# Altium schematic sheet esp-wroom-32.SchDoc
size A1
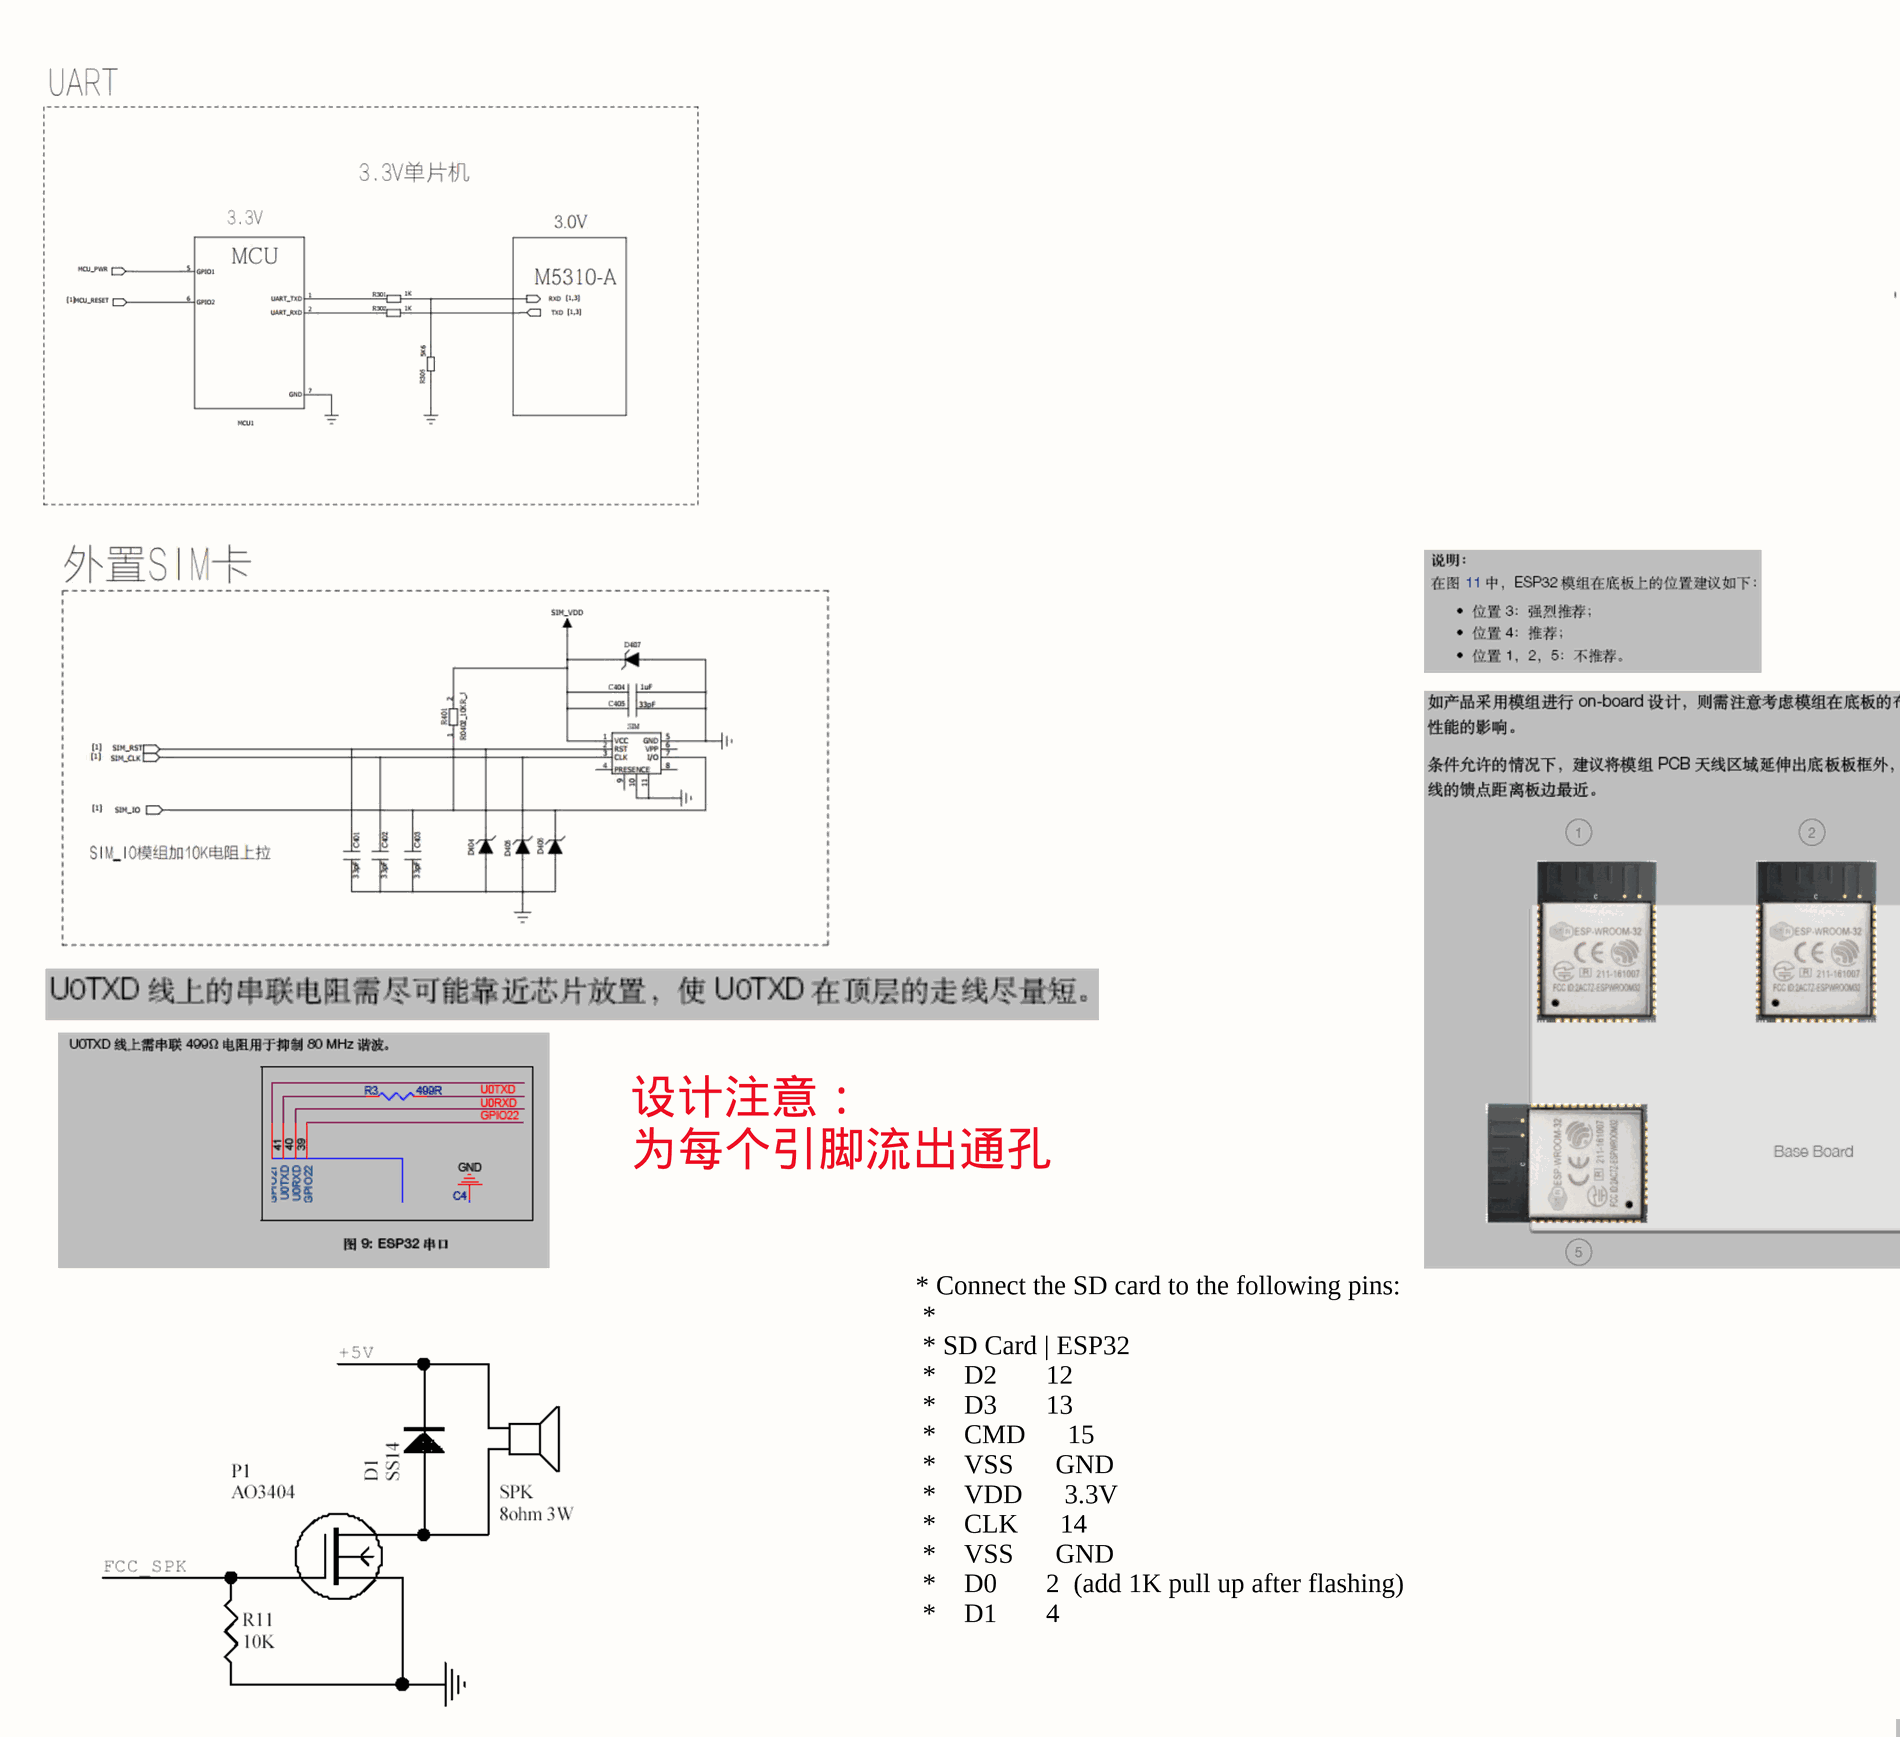
[diagram p0: esp-wroom-32.SchDoc, top left]
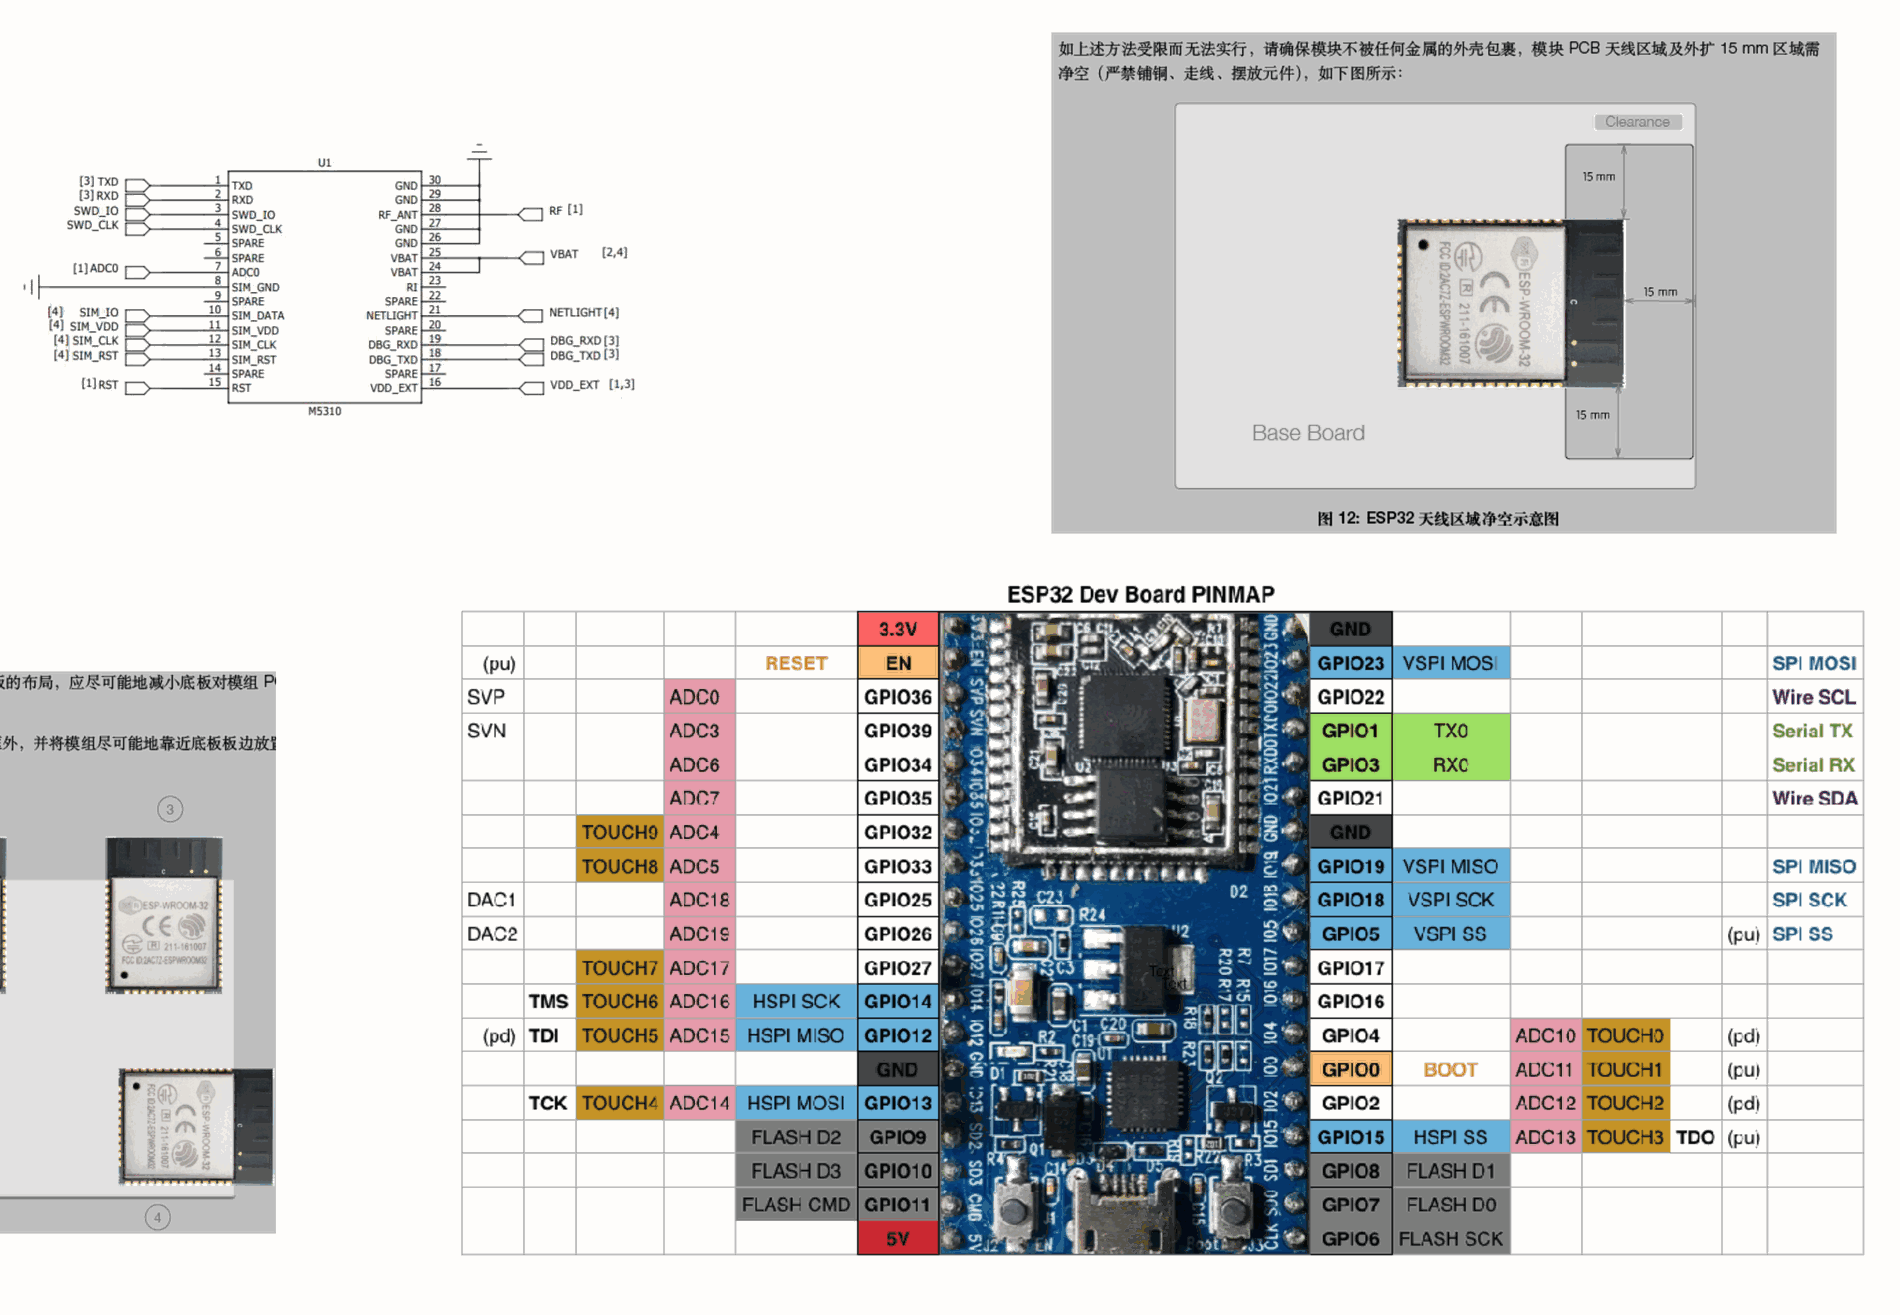
[diagram p1: esp-wroom-32.SchDoc, top right]
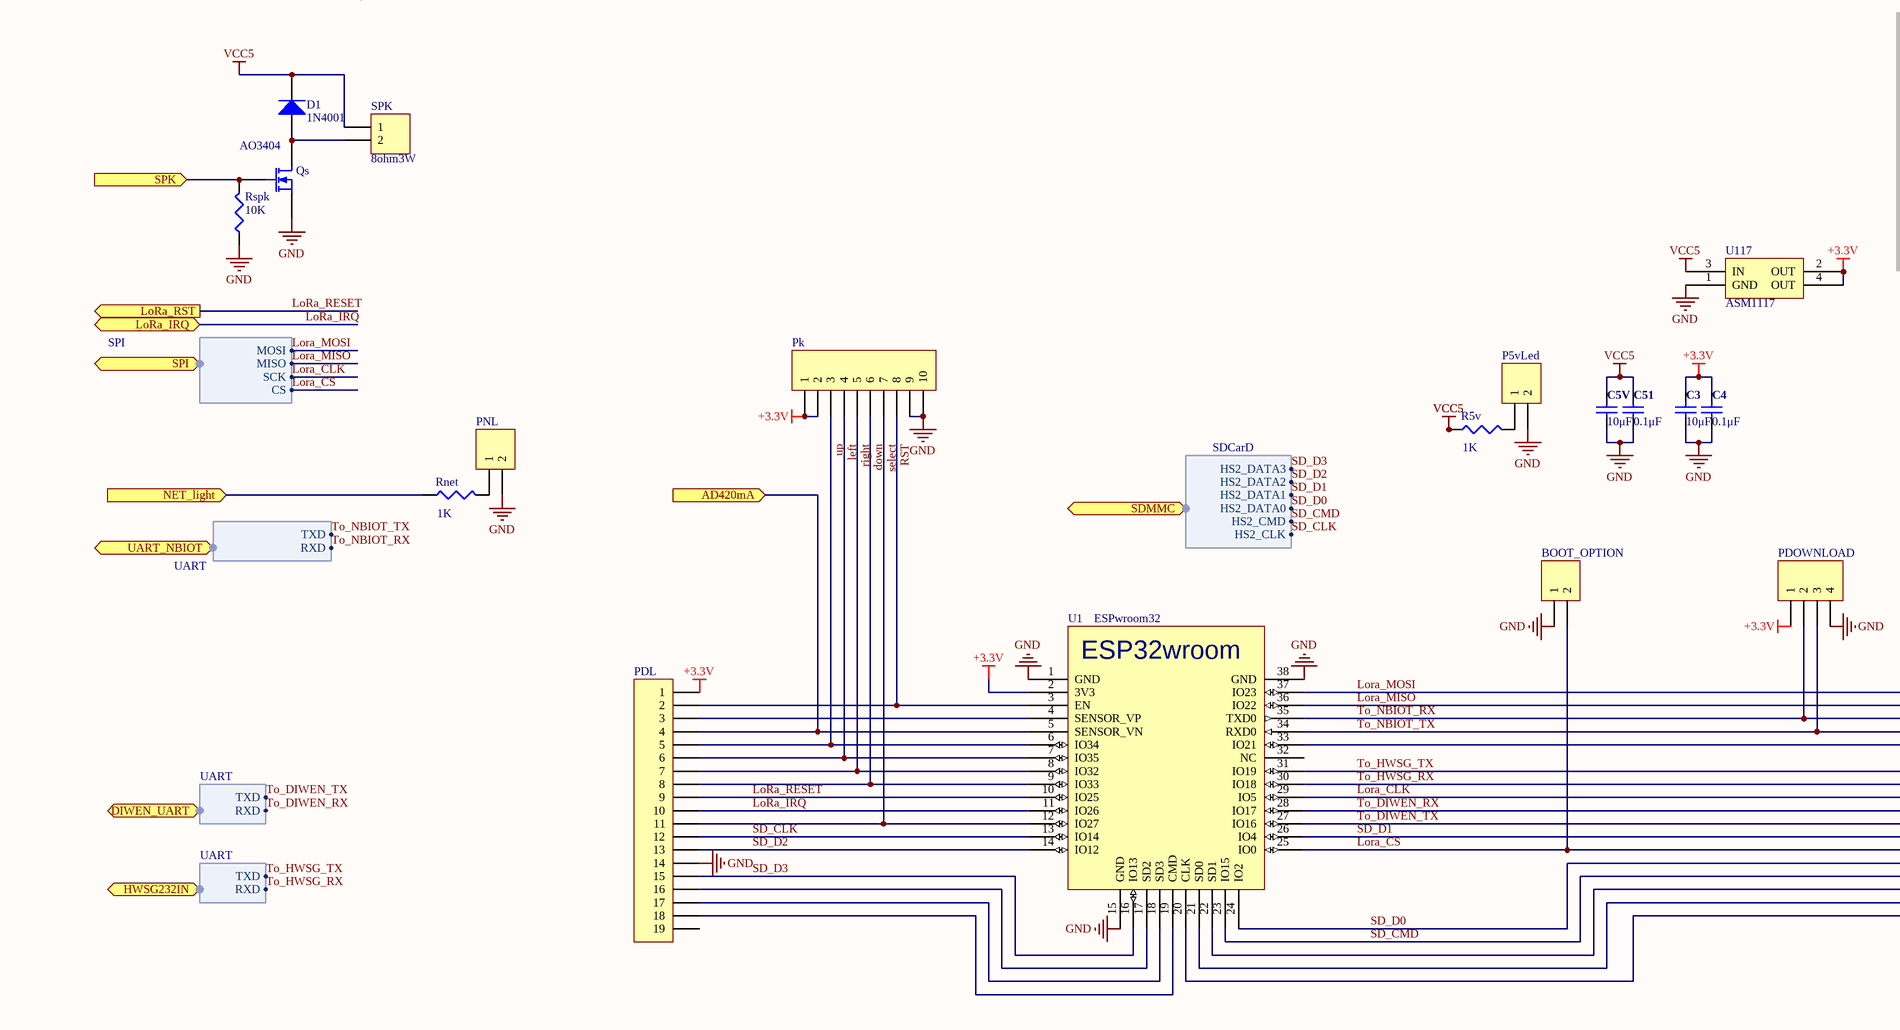
[diagram p2: esp-wroom-32.SchDoc, bottom left]
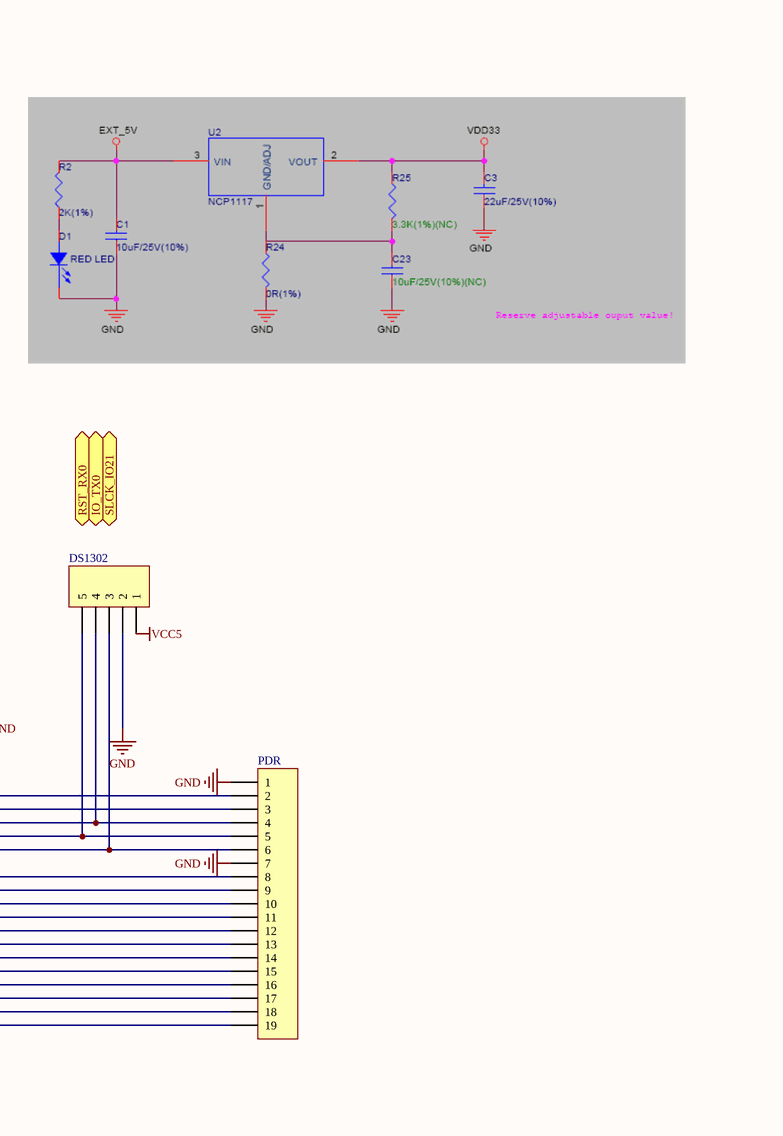
[diagram p3: esp-wroom-32.SchDoc, bottom right]

## Parts
BOOT_OPTION  Header 2  [HDR1X2]  (value not drawn)
C3  10μF  [CAP-7343]
C4  0.1μF  [0805-1]
C5V  10μF  [CAP-7343]
C51  0.1μF  [0805-1]
D1  Type: 1N4001  [DIODE-1206]  (hidden comment: SS14)
DS1302  Header 5  [HDR1X5]  (value not drawn)
P5vLed  Header 2  [HDR1X2]  (value not drawn)
PDL  Header 19  [HDR1X19]  (value not drawn)
PDOWNLOAD  Header 4  [HDR1X4]  (value not drawn)
PDR  Header 19  [HDR1X19]  (value not drawn)
Pk  Header 10  [HDR1X10]  (value not drawn)
PNL  Header 2  [HDR1X2]  (value not drawn)
Qs  AO3404  [E3]
R5v  value 1K  [0805]  (hidden comment: Res3)
Rnet  value 1K  [0805]  (hidden comment: Res3)
Rspk  value 10K  [0805]  (hidden comment: Res3)
SPK  8ohm3W  [HDR1X2]
U1  ESPwroom32  [PCBComponent_1 - duplicate]
U117  ASM1117  [SOT-223]

## Ports
AD420mA (in), DIWEN_UART (harness UART), HWSG232IN (harness UART), IO_TX0 (bidir), LoRa_IRQ (bidir), LoRa_RST (out), NET_light (in), RST_RX0 (in), SDMMC (harness SDCarD), SLCK_IO21 (in), SPI (harness SPI), SPK (in), UART_NBIOT (harness UART)

## Harnesses
SPI: MOSI, MISO, SCK, CS
UART: TXD, RXD
SDCarD: HS2_DATA3, HS2_DATA2, HS2_DATA1, HS2_DATA0, HS2_CMD, HS2_CLK

## Nets
+3.3V: C3.2 C4.2 PDL.1 PDOWNLOAD.1 Pk.1 Pk.2 U1.2(3V3) U117.2(OUT) U117.4(OUT)
GND: BOOT_OPTION.1 C3.1 C4.1 C5V.1 C51.1 DS1302.2 P5vLed.2 PDL.14 PDOWNLOAD.4 PDR.1 PDR.7 Pk.9 Pk.10 PNL.2 Qs.3(S) Rspk.1 U1.1(GND) U1.15(GND) U1.38(GND) U117.1(GND)
VCC5: C5V.2 C51.2 D1.2(K) DS1302.1 R5v.1 SPK.1 U117.3(IN)
AD420mA: PDL.4 U1.5(SENSOR_VN) ; port AD420mA
down: PDL.8 Pk.6 U1.9(IO33)
left: PDL.6 Pk.4 U1.7(IO35)
Lora_CLK: PDR.10 U1.29(IO5) ; port SPI.SCK
Lora_CS: BOOT_OPTION.2 PDR.14 U1.25(IO0) ; port SPI.CS
LoRa_IRQ: PDL.10 U1.11(IO26) ; port LoRa_IRQ
Lora_MISO: PDR.3 U1.36(IO22) ; port SPI.MISO
Lora_MOSI: PDR.2 U1.37(IO23) ; port SPI.MOSI
LoRa_RESET: PDL.9 U1.10(IO25) ; port LoRa_RST
NET_light: Rnet.1 ; port NET_light
right: PDL.7 Pk.5 U1.8(IO32)
RST: PDL.2 Pk.8 U1.3(EN)
SD_CLK: PDL.12 U1.13(IO14) ; port SDMMC.HS2_CLK
SD_CMD: PDR.16 U1.23(IO15) ; port SDMMC.HS2_CMD
SD_D0: PDR.15 U1.24(IO2) ; port SDMMC.HS2_DATA0
SD_D1: PDR.13 U1.26(IO4) ; port SDMMC.HS2_DATA1
SD_D2: PDL.13 U1.14(IO12) ; port SDMMC.HS2_DATA2
SD_D3: PDL.15 U1.16(IO13) ; port SDMMC.HS2_DATA3
select: PDL.11 Pk.7 U1.12(IO27)
SPK: Qs.2(G) Rspk.2 ; port SPK
To_DIWEN_RX: PDR.11 U1.28(IO17) ; port DIWEN_UART.RXD
To_DIWEN_TX: PDR.12 U1.27(IO16) ; port DIWEN_UART.TXD
To_HWSG_RX: PDR.9 U1.30(IO18) ; port HWSG232IN.RXD
To_HWSG_TX: PDR.8 U1.31(IO19) ; port HWSG232IN.TXD
To_NBIOT_RX: DS1302.4 PDOWNLOAD.2 PDR.4 U1.35(TXD0) ; port UART_NBIOT.RXD
To_NBIOT_TX: DS1302.5 PDOWNLOAD.3 PDR.5 U1.34(RXD0) ; port UART_NBIOT.TXD
up: PDL.5 Pk.3 U1.6(IO34)
NetD1_1: D1.1(A) Qs.1(D) SPK.2
NetDS1302_3: DS1302.3 PDR.6 U1.33(IO21)
NetP5vLed_1: P5vLed.1 R5v.2
NetPDL_3: PDL.3 U1.4(SENSOR_VP)
NetPDL_16: PDL.16 U1.17(SD2)
NetPDL_17: PDL.17 U1.18(SD3)
NetPDL_18: PDL.18 U1.19(CMD)
NetPDR_17: PDR.17 U1.22(SD1)
NetPDR_18: PDR.18 U1.21(SD0)
NetPDR_19: PDR.19 U1.20(CLK)
NetPNL_1: PNL.1 Rnet.2

Not connected (* = marked no-connect by the designer): PDL 19; U1 32(NC)

## Notes on the sheet
- 设计注意：
  为每个引脚流出通孔
- * Connect the SD card to the following pins:
  *
  * SD Card | ESP32
  *    D2       12
  *    D3       13
  *    CMD      15
  *    VSS      GND
  *    VDD      3.3V
  *    CLK      14
  *    VSS      GND
  *    D0       2  (add 1K pull up after flashing)
  *    D1       4
  */
- (in symbol ESPwroom32) ESP32wroom

## Library data of the parts
BOOT_OPTION P5vLed PNL SPK = Header 2: Header, 2-Pin; LatestRevisionDate: 17-Jul-2002; LatestRevisionNote: Re-released for DXP Platform.; Publisher: Altium Limited
C3 C4 C51 = Cap: 贴片电容; 名称: 电容; 封装: 0805; 型号: 1μF
C5V = Cap: 贴片电容; 名称: 电容; 封装: 0805; 型号: 10μF
D1 = Diode: 二极管; Published: 8-Jun-2000; LatestRevisionDate: 17-Jul-2002; LatestRevisionNote: Re-released for DXP Platform.; PackageDocument: Sep-1996; PackageReference: SMC; Publisher: Altium Limited; Code_JEDEC: DO-214-AB
DS1302 = Header 5: Header, 5-Pin; LatestRevisionDate: 17-Jul-2002; LatestRevisionNote: Re-released for DXP Platform.; Publisher: Altium Limited
PDL PDR = Header 19: Header, 19-Pin; LatestRevisionDate: 17-Jul-2002; LatestRevisionNote: Re-released for DXP Platform.; Publisher: Altium Limited
PDOWNLOAD = Header 4: Header, 4-Pin; LatestRevisionDate: 17-Jul-2002; LatestRevisionNote: Re-released for DXP Platform.; Publisher: Altium Limited
Pk = Header 10: Header, 10-Pin; LatestRevisionDate: 17-Jul-2002; LatestRevisionNote: Re-released for DXP Platform.; Publisher: Altium Limited
Qs = MOSFET-N: N-Channel MOSFET; Published: 8-Jun-2000; LatestRevisionDate: 17-Jul-2002; LatestRevisionNote: Re-released for DXP Platform.; PackageVersion: 1995/1996; PackageReference: E3; Publisher: Altium Limited; PackageDescription: TO, Flat Index; 3 In-Line, Axial Leads; Body Dia. 4.6mm; Lead Dia. 0.5 mm (max)
R5v Rnet Rspk = Res3: Resistor; Published: 8-Jun-2000; LatestRevisionDate: 29-May-2009; LatestRevisionNote: IPC-7351 Footprint Added.; PackageReference: J1-0603; Publisher: Altium Limited; PackageDescription: Chip Resistor
U117 = ASM1117: 3.3V稳压芯片